# EAGLE design Curing_cab (EAGLE 7.2.0)
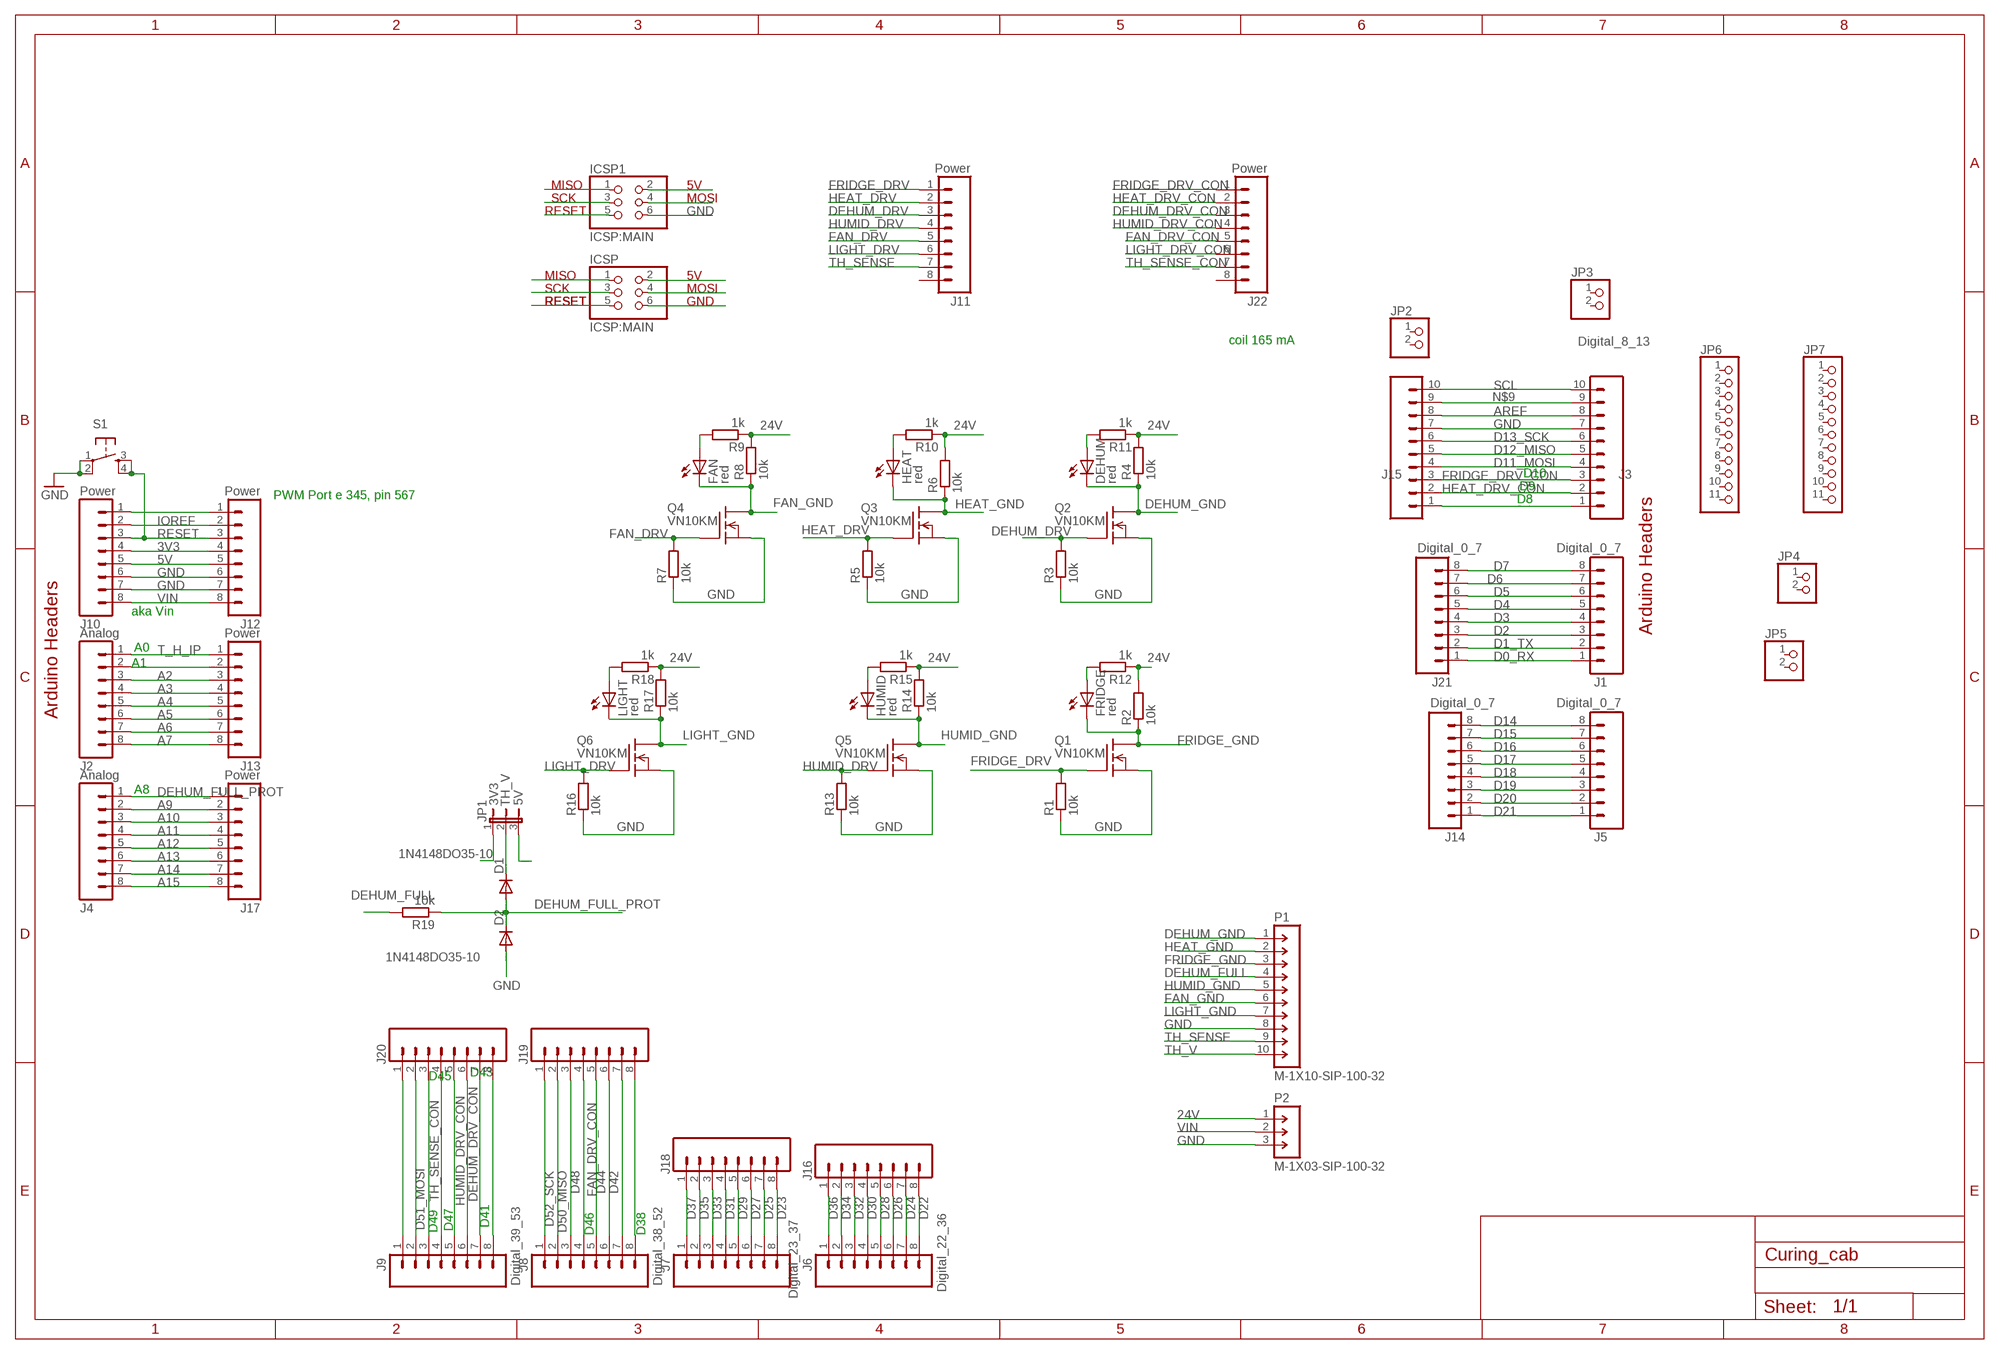
[diagram p0: schematic, sheet 1]

## Parts
D1  1N4148DO35-10  [DO35-10]
D2  1N4148DO35-10  [DO35-10]
DEHUM  red  LED3MM  [LED3MM]
FAN  red  LED3MM  [LED3MM]
FRIDGE  red  LED3MM  [LED3MM]
HEAT  red  LED3MM  [LED3MM]
HUMID  red  LED3MM  [LED3MM]
ICSP  ICSP:MAIN  PINHD-2X3  [2X03]
ICSP1  ICSP:MAIN  PINHD-2X3  [2X03]
J1  Digital_0_7  M08  [1X08]
J2  Analog  M08  [1X08]
J3  Digital_8_13  M100.1  [1X10]
J4  Analog  M08  [1X08]
J5  Digital_0_7  M08  [1X08]
J6  Digital_22_36  M08  [1X08]
J7  Digital_23_37  M08  [1X08]
J8  Digital_38_52  M08  [1X08]
J9  Digital_39_53  M08  [1X08]
J10  Power  M08  [1X08]
J11  Power  M08  [1X08]
J12  Power  M08  [1X08]
J13  Power  M08  [1X08]
J14  Digital_0_7  M08  [1X08]
J15  Digital_8_13  M100.1  [1X10]
J16  Digital_22_36  M08  [1X08]
J17  Power  M08  [1X08]
J18  Digital_22_36  M08  [1X08]
J19  Digital_22_36  M08  [1X08]
J20  Digital_22_36  M08  [1X08]
J21  Digital_0_7  M08  [1X08]
J22  Power  M08  [1X08]
JP1  JP2E  [JP2]
JP2  PINHD-1X2  [1X02]
JP3  PINHD-1X2  [1X02]
JP4  PINHD-1X2  [1X02]
JP5  PINHD-1X2  [1X02]
JP6  PINHD-1X11  [1X11]
JP7  PINHD-1X11  [1X11]
LIGHT  red  LED3MM  [LED3MM]
P1  M-1X10-SIP-100-32  [SIP-100-10-32]
P2  M-1X03-SIP-100-32  [SIP-100-03-32]
Q1  VN10KM  [TO237]
Q2  VN10KM  [TO237]
Q3  VN10KM  [TO237]
Q4  VN10KM  [TO237]
Q5  VN10KM  [TO237]
Q6  VN10KM  [TO237]
R1  10k  R-EU_0204/7  [0204/7]
R2  10k  R-EU_0204/7  [0204/7]
R3  10k  R-EU_0204/7  [0204/7]
R4  10k  R-EU_0204/7  [0204/7]
R5  10k  R-EU_0204/7  [0204/7]
R6  10k  R-EU_0204/7  [0204/7]
R7  10k  R-EU_0204/7  [0204/7]
R8  10k  R-EU_0204/7  [0204/7]
R9  1k  R-EU_0204/7  [0204/7]
R10  1k  R-EU_0204/7  [0204/7]
R11  1k  R-EU_0204/7  [0204/7]
R12  1k  R-EU_0204/7  [0204/7]
R13  10k  R-EU_0204/7  [0204/7]
R14  10k  R-EU_0204/7  [0204/7]
R15  1k  R-EU_0204/7  [0204/7]
R16  10k  R-EU_0204/7  [0204/7]
R17  10k  R-EU_0204/7  [0204/7]
R18  1k  R-EU_0204/7  [0204/7]
R19  10k  R-EU_0204/7  [0204/7]
S1  TAC_SWITCHPTH  [TACTILE-PTH]

## Nets
3V3: J10.4 J12.4 JP1.1
5V: J10.5 J12.5 JP1.3
5V_1: ICSP1.2 ICSP.2
24V: P2.1 R2.2 R4.2 R6.2 R8.2 R9.1 R10.1 R11.1 R12.1 R14.2 R15.1 R17.2 R18.1
A2: J2.3 J13.3
A3: J2.4 J13.4
A4: J2.5 J13.5
A5: J2.6 J13.6
A6: J2.7 J13.7
A7: J2.8 J13.8
A9: J4.2 J17.2
A10: J4.3 J17.3
A11: J4.4 J17.4
A12: J4.5 J17.5
A13: J4.6 J17.6
A14: J4.7 J17.7
A15: J4.8 J17.8
AREF: J3.8 J15.8
D0_RX: J1.1 J21.1
D1_TX: J1.2 J21.2
D2: J1.3 J21.3
D3: J1.4 J21.4
D4: J1.5 J21.5
D5: J1.6 J21.6
D6: J1.7 J21.7
D7: J1.8 J21.8
D11_MOSI: J3.4 J15.4
D12_MISO: J3.5 J15.5
D13_SCK: J3.6 J15.6
D14: J5.8 J14.8
D15: J5.7 J14.7
D16: J5.6 J14.6
D17: J5.5 J14.5
D18: J5.4 J14.4
D19: J5.3 J14.3
D20: J5.2 J14.2
D21: J5.1 J14.1
D22: J6.8 J16.8
D23: J7.8 J18.8
D24: J6.7 J16.7
D25: J7.7 J18.7
D26: J6.6 J16.6
D27: J7.6 J18.6
D28: J6.5 J16.5
D29: J7.5 J18.5
D30: J6.4 J16.4
D31: J7.4 J18.4
D32: J6.3 J16.3
D33: J7.3 J18.3
D34: J6.2 J16.2
D35: J7.2 J18.2
D36: J6.1 J16.1
D37: J7.1 J18.1
D42: J8.6 J19.6
D44: J8.5 J19.5
D48: J8.3 J19.3
D50_MISO: J8.2 J19.2
D51_MOSI: J9.2 J20.2
D52_SCK: J8.1 J19.1
D53: J9.1 J20.1
DEHUM_DRV: J11.3 Q2.2(G) R3.2
DEHUM_DRV_CON: J9.6 J20.6 J22.3
DEHUM_FULL: P1.4 R19.2
DEHUM_FULL_PROT: D1.A D2.C J4.1 J17.1 R19.1
DEHUM_GND: DEHUM.K(C) P1.1 Q2.1(D) R4.1
FAN_DRV: J11.5 Q4.2(G) R7.2
FAN_DRV_CON: J8.4 J19.4 J22.5
FAN_GND: FAN.K(C) P1.6 Q4.1(D) R8.1
FRIDGE_DRV: J11.1 Q1.2(G) R1.2
FRIDGE_DRV_CON: J3.3 J15.3 J22.1
FRIDGE_GND: FRIDGE.K(C) P1.3 Q1.1(D) R2.1
GND: D2.A ICSP1.6 ICSP.6 J3.7 J10.6 J10.7 J12.6 J12.7 J15.7 P1.8 P2.3 Q1.3(S) Q2.3(S) Q3.3(S) Q4.3(S) Q5.3(S) Q6.3(S) R1.1 R3.1 R5.1 R7.1 R13.1 R16.1 S1.1 S1.2
HEAT_DRV: J11.2 Q3.2(G) R5.2
HEAT_DRV_CON: J3.2 J15.2 J22.2
HEAT_GND: HEAT.K(C) P1.2 Q3.1(D) R6.1
HUMID_DRV: J11.4 Q5.2(G) R13.2
HUMID_DRV_CON: J9.5 J20.5 J22.4
HUMID_GND: HUMID.K(C) P1.5 Q5.1(D) R14.1
IOREF: J10.2 J12.2
LIGHT_DRV: J11.6 Q6.2(G) R16.2
LIGHT_DRV_CON: J9.4 J20.4 J22.6
LIGHT_GND: LIGHT.K(C) P1.7 Q6.1(D) R17.1
MISO_1: ICSP1.1 ICSP.1
MOSI_1: ICSP1.4 ICSP.4
N$1: HUMID.A R15.2
N$2: FAN.A R9.2
N$3: DEHUM.A R11.2
N$4: LIGHT.A R18.2
N$5: HEAT.A R10.2
N$7: J3.1 J15.1
N$8: FRIDGE.A R12.2
N$9: J3.9 J15.9
N$10: J2.2 J13.2
N$11: J9.7 J20.7
N$12: J9.8 J20.8
N$13: J8.8 J19.8
N$14: J8.7 J19.7
N$314: J10.1 J12.1
RESET: J10.3 J12.3 S1.3 S1.4
RESET_1: ICSP1.5 ICSP.5
SCK_1: ICSP1.3 ICSP.3
SCL: J3.10 J15.10
T_H_IP: J2.1 J13.1
TH_SENSE: J11.7 P1.9
TH_SENSE_CON: J9.3 J20.3 J22.7
TH_V: D1.C JP1.2 P1.10
VIN: J10.8 J12.8 P2.2
Unconnected: J11.8 J22.8 JP2.1 JP2.2 JP3.1 JP3.2 JP4.1 JP4.2 JP5.1 JP5.2 JP6.1 JP6.2 JP6.3 JP6.4 JP6.5 JP6.6 JP6.7 JP6.8 JP6.9 JP6.10 JP6.11 JP7.1 JP7.2 JP7.3 JP7.4 JP7.5 JP7.6 JP7.7 JP7.8 JP7.9 JP7.10 JP7.11

## Notes on the sheet
- MISO | 5V
- SCK | MOSI
- RESET
- MISO | 5V
- SCK | MOSI
- RESET | RESET | GND
- coil 165 mA
- D10
- D9
- PWM Port e 345, pin 567
- D8
- aka Vin
- Arduino Headers
- A0
- A1
- Arduino Headers
- A8
- D43
- D45
- D47
- D41
- D49 | D46 | D38

## Library data of the parts
D1 D2 = diode:1N4148: DIODE high speed (Philips)
DEHUM FAN FRIDGE HEAT HUMID LIGHT = led:LED: LED OSRAM: - CHIPLED LG R971, LG N971, LY N971, LG Q971, LY Q971, LO R971, LY R971 LH N974, LH R974 LS Q976, LO Q976, LY Q976 LO Q996 - Hyper CHIPLED LW Q18S LB Q993, LB Q99A, LB R99A - SideLED LS A670, LO A670, LY A670, LG A670, LP A670 LB A673, LV A673, LT A673, LW A673 LH A674 LY A675 LS A676, LA A676, LO A676, LY A676, LW A676 LS A679, LY A679, LG A679 - Hyper Micro SIDELED® LS Y876, LA Y876, LO Y876, LY Y876 LT Y87S - SmartLED LW L88C, LW L88S LB L89C, LB L89S, LG L890 LS L89K, LO L89K, LY L89K LS L896, LA L896, LO L896, LY L896 - TOPLED LS T670, LO T670, LY T670, LG T670, LP T670 LSG T670, LSP T670, LSY T670, LOP T670, LYG T670 LG T671, LOG T671, LSG T671 LB T673, LV T673, LT T673, LW T673 LH T674 LS T676, LA T676, LO T676, LY T676, LB T676, LH T676, LSB T676, LW T676 LB T67C, LV T67C, LT T67C, LS T67K, LO T67K, LY T67K, LW E67C LS E67B, LA E67B, LO E67B, LY E67B, LB E67C, LV E67C, LT E67C LW T67C LS T679, LY T679, LG T679 LS T770, LO T770, LY T770, LG T770, LP T770 LB T773, LV T773, LT T773, LW T773 LH T774 LS E675, LA E675, LY E675, LS T675 LS T776, LA T776, LO T776, LY T776, LB T776 LHGB T686 LT T68C, LB T68C - Hyper Mini TOPLED® LB M676 - Mini TOPLED Santana® LG M470 LS M47K, LO M47K, LY M47K Source: http://www.osram.convergy.de LUXEON: - LUMILED® LXK2-PW12-R00, LXK2-PW12-S00, LXK2-PW14-U00, LXK2-PW14-V00 LXK2-PM12-R00, LXK2-PM12-S00, LXK2-PM14-U00 LXK2-PE12-Q00, LXK2-PE12-R00, LXK2-PE12-S00, LXK2-PE14-T00, LXK2-PE14-U00 LXK2-PB12-K00, LXK2-PB12-L00, LXK2-PB12-M00, LXK2-PB14-N00, LXK2-PB14-P00, LXK2-PB14-Q00 LXK2-PR12-L00, LXK2-PR12-M00, LXK2-PR14-Q00, LXK2-PR14-R00 LXK2-PD12-Q00, LXK2-PD12-R00, LXK2-PD12-S00 LXK2-PH12-R00, LXK2-PH12-S00 LXK2-PL12-P00, LXK2-PL12-Q00, LXK2-PL12-R00 Source: www.luxeon.com KINGBRIGHT: KA-3528ASYC Source: www.kingbright.com
ICSP ICSP1 = pinhead:PINHD-2X3: PIN HEADER
J1 J5-J9 J14 J16 J18-J21 = freetronics:M08: Header 8 Standard 8-pin 0.1" header. Use with straight break away headers (SKU : PRT-00116), right angle break away headers (PRT-00553), swiss pins (PRT-00743), machine pins (PRT-00117), and female headers (PRT-00115).
J2 J4 J10-J13 J17 J22 = freetronics-master-v1:M08: Header 8 Standard 8-pin 0.1" header. Use with straight break away headers (SKU : PRT-00116), right angle break away headers (PRT-00553), swiss pins (PRT-00743), machine pins (PRT-00117), and female headers (PRT-00115).
J3 J15 = freetronics-original:M10: Header 10 Standard 10-pin 0.1" header. Use with straight break away headers (SKU : PRT-00116), right angle break away headers (PRT-00553), swiss pins (PRT-00743), machine pins (PRT-00117), and female headers (PRT-00115).
JP1 = jumper:JP2E: JUMPER
JP2-JP5 = pinhead:PINHD-1X2: PIN HEADER
JP6 JP7 = pinhead:PINHD-1X11: PIN HEADER
P1 = con-headers-jp:M-1X10-: MALE HEADER
P2 = con-headers-jp:M-1X03-: MALE HEADER
Q1-Q6 = Trevs:VN10: N-Channel Enhancement MOSFET (VMOS); 60V; 0,5A; 5,0Ohm
R1-R19 = resistor:R-EU_: RESISTOR, European symbol
S1 = freetronics-master-v1:TAC_SWITCH: Momentary Switch Button commonly used for reset or general input. Spark Fun Electronics SKU : COM-00097

## Board
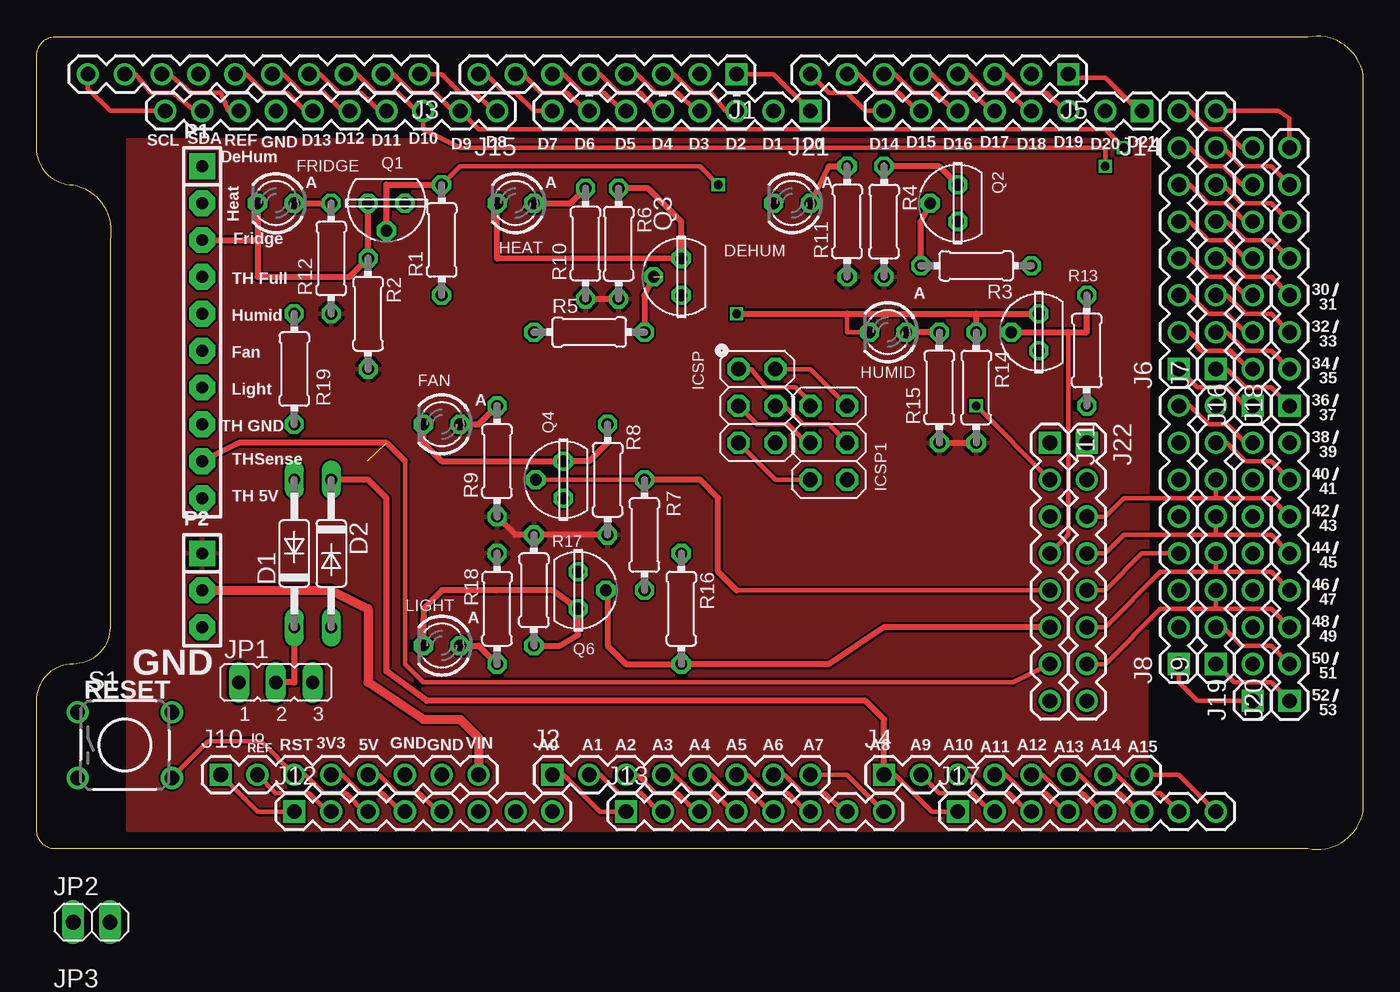
[diagram p1: board, top side]
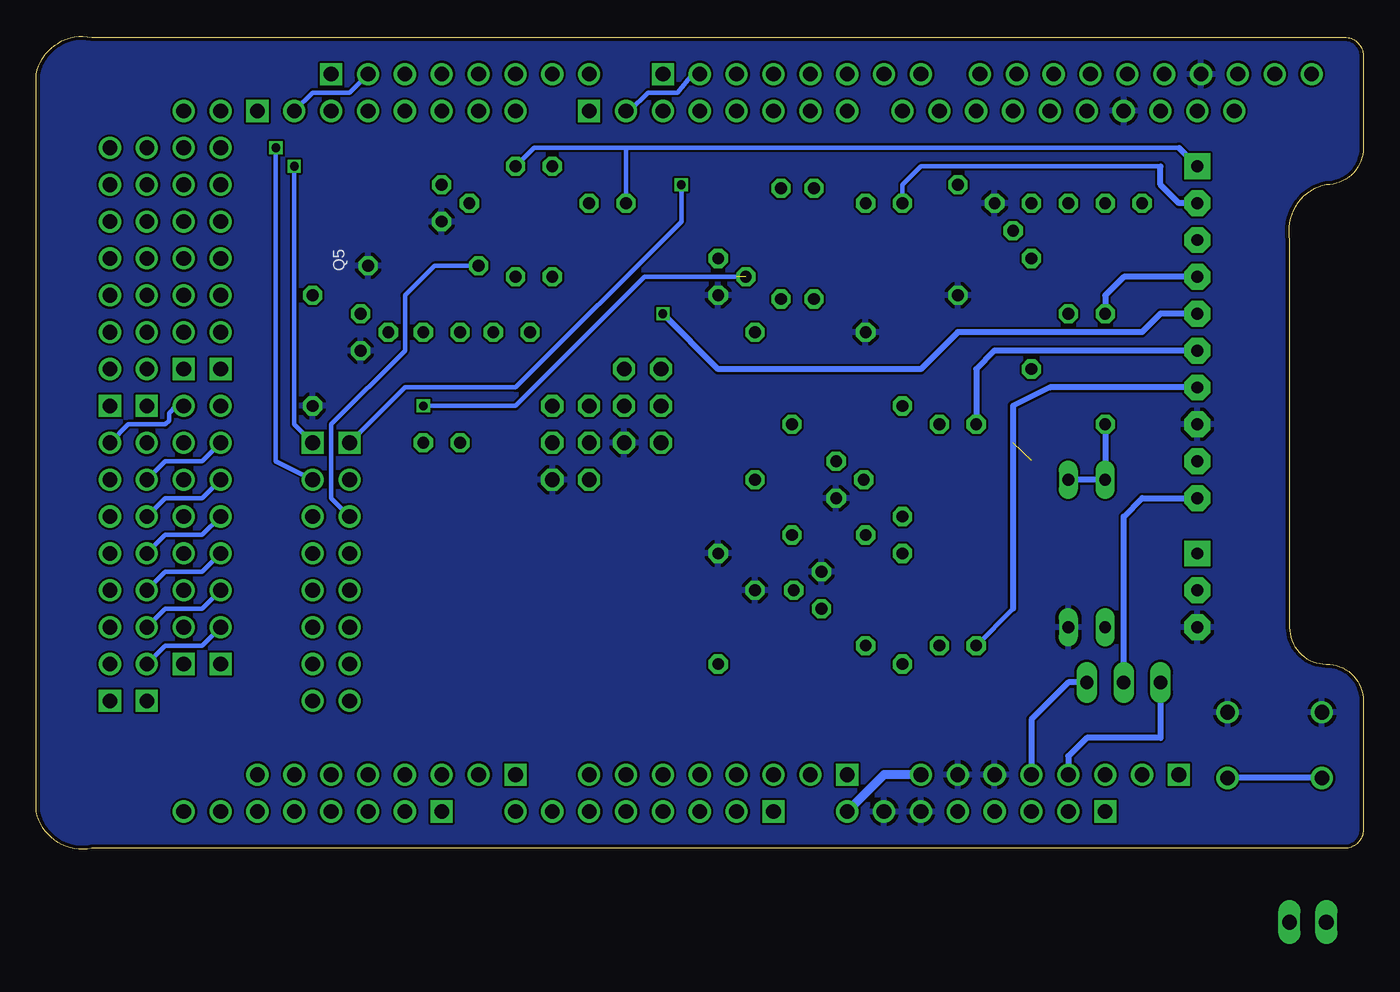
[diagram p2: board, bottom side, seen from below]

Size 91.44 x 56.01 mm. Coordinates in mm from the lower left corner, seen from the top.
Outline: 0,1.33 arc90 1.27,0.06 87.63,0.06 arc90 91.44,2.6 91.44,53.4 arc90 87.63,55.94 1.27,55.94 arc90 0,54.67 0,48.32 arc90 2.54,45.78 arc-90 5.08,41.97 5.08,15.3 arc-90 2.54,12.76 arc90 0,10.22 0,1.33
Copper layers (1*16): Top 0.035mm / dielectric 1.5mm / Bottom 0.035mm
Design rules "SeeedStudio_2layer_DRU_no_angle_20140221": minimum track width 6mil, minimum drill 12mil, track to track 6mil, track to pad 6mil, pad to pad 6mil, via to via 6mil, smd to smd 0mil, copper to edge 10mil, drill to drill 10mil, minimum pad ring 10mil, minimum via ring 6mil, stop-mask expansion 2mil, vias tented up to drill 100mil, thermal gap 10mil

### Footprints (pad centres in the part's own frame; a part is rotated, then mirrored left to right if it is on the bottom)
DO35-10 = drill 0.813 long: A 5.08,0; C -5.08,0
LED3MM = drill 0.813 octagon: A -1.27,0; K 1.27,0
2X03 = drill 1.016 octagon: 1 -2.54,-1.27; 2 -2.54,1.27; 3 0,-1.27; 4 0,1.27; 5 2.54,-1.27; 6 2.54,1.27
1X08 = drill 1.016 square: 1 0,0 | drill 1.016: 2 2.54,0; 3 5.08,0; 4 7.62,0; 5 10.16,0; 6 12.7,0; 7 15.24,0; 8 17.78,0
1X10 = drill 1.016: 1 0,0; 2 2.54,0; 3 5.08,0; 4 7.62,0; 5 10.16,0; 6 12.7,0; 7 15.24,0; 8 17.78,0; 9 20.32,0; 10 22.86,0
JP2 = drill 0.914 long: 1 -2.54,0; 2 0,0; 3 2.54,0
1X02 = drill 1.016 long: 1 -1.27,0; 2 1.27,0
1X11 = drill 1.016 long: 1 -12.7,0; 2 -10.16,0; 3 -7.62,0; 4 -5.08,0; 5 -2.54,0; 6 0,0; 7 2.54,0; 8 5.08,0; 9 7.62,0; 10 10.16,0; 11 12.7,0
SIP-100-10-32 = drill 0.813 pad 1.778 square: 1 -11.43,0 | drill 0.813 pad 1.778 octagon: 2 -8.89,0; 3 -6.35,0; 4 -3.81,0; 5 -1.27,0; 6 1.27,0; 7 3.81,0; 8 6.35,0; 9 8.89,0; 10 11.43,0
SIP-100-03-32 = drill 0.813 pad 1.778 square: 1 -2.54,0 | drill 0.813 pad 1.778 octagon: 2 0,0; 3 2.54,0
TO237 = drill 0.813 octagon: 1 1.27,0; 2 0,1.905; 3 -1.27,0
0204/7 = drill 0.813 octagon: 1 -3.81,0; 2 3.81,0
TACTILE-PTH = drill 1.016: 1 -3.251,2.261; 2 3.251,2.261; 3 -3.251,-2.261; 4 3.251,-2.261

### Placement (x,y rotation side)
D1  17.78,20.38 90 top
D2  20.32,20.38 270 top
DEHUM  52.07,44.51 180 top
FAN  27.94,29.27 180 top
FRIDGE  16.51,44.51 180 top
HEAT  33.02,44.51 180 top
HUMID  58.67,35.62 180 top
ICSP  49.66,30.54 270 top
ICSP1  54.61,28 270 top
J1  48.26,53.4 180 top
J2  35.56,5.14 0 top
J3  26.42,53.4 180 top
J4  58.42,5.14 0 top
J5  71.12,53.4 180 top
J6  78.74,33.08 90 top
J7  81.28,33.08 90 top
J8  78.74,12.76 90 top
J9  81.28,12.76 90 top
J10  12.7,5.14 0 top
J11  69.85,28 270 top
J12  17.78,2.6 0 top
J13  40.64,2.6 0 top
J14  76.2,50.86 180 top
J15  31.75,50.86 180 top
J16  83.82,30.54 90 top
J17  63.5,2.6 0 top
J18  86.36,30.54 90 top
J19  83.82,10.22 90 top
J20  86.36,10.22 90 top
J21  53.34,50.86 180 top
J22  72.39,28 270 top
JP1  16.51,11.49 0 top
JP2  3.81,-5.02 0 top  (outside the outline)
JP3  3.81,-11.37 0 top  (outside the outline)
JP4  3.81,-17.72 0 top  (outside the outline)
JP5  3.81,-24.07 0 top  (outside the outline)
JP6  15.24,-30.42 0 top  (outside the outline)
JP7  15.24,-36.77 0 top  (outside the outline)
LIGHT  27.94,14.03 180 top
P1  11.43,35.62 270 top
P2  11.43,17.84 270 top
Q1  24.13,44.51 180 top
Q2  63.5,44.51 90 top
Q3  44.45,39.43 90 top
Q4  36.32,25.46 90 top
Q5  69.09,35.62 90 top
Q6  37.34,17.84 270 top
R1  27.94,41.97 90 top
R2  22.86,36.89 270 top
R3  64.77,40.19 180 top
R4  58.42,43.24 270 top
R5  38.1,35.62 0 top
R6  40.13,41.72 270 top
R7  41.91,21.65 90 top
R8  39.37,25.46 270 top
R9  31.75,26.73 90 top
R10  37.85,41.72 90 top
R11  55.88,43.24 90 top
R12  20.32,40.7 90 top
R13  72.39,34.35 90 top
R14  64.77,31.81 270 top
R15  62.23,31.81 90 top
R16  44.45,16.57 270 top
R17  34.29,17.84 90 top
R18  31.75,16.57 270 top
R19  17.78,33.08 90 top
S1  6.1,7.17 0 top

### Tracks (layer width: path | path; a pad name or v marks a point on that pad's centre or on a via)
3V3
  Top 0.305: J10.4 21.08,5.14 22.35,3.87 23.88,3.87 25.15,2.6 J12.4
  Bottom 0.406: JP1.1 13.97,7.68 19.05,7.68 20.32,6.41 J10.4
5V
  Top 0.305: J10.5 23.62,5.14 24.89,3.87 26.42,3.87 27.69,2.6 J12.5
  Bottom 0.406: JP1.3 20.32,11.49 22.86,8.95 J10.5
5V_1
  Top 0.305: ICSP.2 53.34,33.08 ICSP1.2
24V
  Top 0.406: R15.1 R14.2 | R9.1 33.02,21.65 R8.2 | R10.1 R6.2
  pour Top: 6.35,48.83 76.71,48.83 76.45,1.33 6.35,1.33
A2
  Top 0.305: J2.3 41.4,5.14 42.67,3.87 44.2,3.87 45.47,2.6 J13.3
A3
  Top 0.305: J2.4 43.94,5.14 45.21,3.87 46.74,3.87 48.01,2.6 J13.4
A4
  Top 0.305: J2.5 46.48,5.14 47.75,3.87 49.28,3.87 50.55,2.6 J13.5
A5
  Top 0.305: J2.6 49.02,5.14 50.29,3.87 51.82,3.87 53.09,2.6 J13.6
A6
  Top 0.305: J2.7 51.56,5.14 52.83,3.87 54.36,3.87 55.63,2.6 J13.7
A7
  Top 0.305: J2.8 55.88,5.14 J13.8
A9
  Top 0.305: J4.2 62.23,3.87 64.52,3.87 65.79,2.6 J17.2
A10
  Top 0.305: J4.3 64.26,5.14 65.53,3.87 67.06,3.87 68.33,2.6 J17.3
A11
  Top 0.305: J4.4 66.8,5.14 68.07,3.87 69.6,3.87 70.87,2.6 J17.4
A12
  Top 0.305: J4.5 69.34,5.14 70.61,3.87 72.14,3.87 73.41,2.6 J17.5
A13
  Top 0.305: J4.6 71.88,5.14 73.15,3.87 74.68,3.87 75.95,2.6 J17.6
A14
  Top 0.305: J4.7 74.42,5.14 75.69,3.87 77.47,3.87 J17.7
A15
  Top 0.305: J4.8 78.74,5.14 J17.8
AREF
  Top 0.305: J3.8 9.14,53.4 10.67,52.13 12.7,52.13 13.21,50.86 J15.8
D0_RX
  Top 0.305: J1.1 50.8,53.4 J21.1
D1_TX
  Bottom 0.305: J1.2 46.23,53.4 47.24,52.13 49.28,52.13 50.55,50.86 J21.2
D2
  Top 0.305: J1.3 43.94,53.4 45.21,52.13 46.48,52.13 47.5,50.86 J21.3
D3
  Top 0.305: J1.4 41.4,53.4 42.67,52.13 44.2,52.13 45.47,50.86 J21.4
D4
  Top 0.305: J1.5 38.86,53.4 40.13,52.13 41.66,52.13 42.67,50.86 J21.5
D5
  Top 0.305: J1.6 36.32,53.4 37.59,52.13 39.12,52.13 40.39,50.86 J21.6
D6
  Top 0.305: J1.7 33.53,53.4 34.8,52.13 36.58,52.13 37.85,50.86 J21.7
D7
  Top 0.305: J1.8 30.99,53.4 32.26,52.13 33.02,52.13 34.29,50.86 J21.8
D11_MOSI
  Top 0.305: J3.4 19.56,53.4 20.83,52.13 22.35,52.13 23.62,50.86 J15.4
D12_MISO
  Top 0.305: J3.5 17.02,53.4 18.29,52.13 19.81,52.13 21.08,50.86 J15.5
D13_SCK
  Top 0.305: J3.6 14.48,53.4 15.75,52.13 17.27,52.13 18.54,50.86 J15.6
D14
  Top 0.305: J5.8 54.61,52.13 55.88,52.13 57.15,50.86 J14.8
D15
  Top 0.305: J5.7 56.64,53.4 57.91,52.13 59.44,52.13 60.71,50.86 J14.7
D16
  Top 0.305: J5.6 59.18,53.4 60.45,52.13 61.98,52.13 63.25,50.86 J14.6
D17
  Top 0.305: J5.5 61.72,53.4 62.99,52.13 64.52,52.13 65.79,50.86 J14.5
D18
  Top 0.305: J5.4 64.26,53.4 65.53,52.13 67.06,52.13 68.33,50.86 J14.4
D19
  Top 0.305: J5.3 66.8,53.4 68.07,52.13 69.6,52.13 70.87,50.86 J14.3
D20
  Bottom 0.305: J5.2 69.85,52.13 72.39,52.13 J14.2
D21
  Top 0.305: J5.1 71.37,53.15 73.66,53.15 75.95,50.86 J14.1
D22
  Top 0.305: J6.8 79.5,50.86 80.77,49.59 81.79,49.59 83.06,48.32 J16.8
D23
  Top 0.305: J7.8 85.6,50.86 86.36,50.35 J18.8
D24
  Top 0.305: J6.7 79.5,48.32 80.77,47.05 81.79,47.05 83.06,45.78 J16.7
D25
  Top 0.305: J7.7 81.79,48.32 83.06,47.05 85.09,47.05 J18.7
D26
  Top 0.305: J6.6 79.5,45.78 80.77,44.51 82.04,44.51 83.31,43.24 J16.6
D27
  Top 0.305: J7.6 81.79,45.78 83.06,44.51 85.09,44.51 J18.6
D28
  Top 0.305: J6.5 79.5,43.24 80.77,41.97 82.04,41.97 83.31,40.7 J16.5
D29
  Top 0.305: J7.5 82.04,43.24 83.31,41.97 85.09,41.97 J18.5
D30
  Top 0.305: J6.4 79.5,40.7 80.77,39.43 82.04,39.43 83.31,38.16 J16.4
D31
  Top 0.305: J7.4 82.04,40.7 83.31,39.43 85.09,39.43 J18.4
D32
  Top 0.305: J6.3 79.5,38.16 80.77,36.89 82.04,36.89 83.31,35.62 J16.3
D33
  Top 0.305: J7.3 82.04,38.16 83.31,36.89 85.09,36.89 J18.3
D34
  Top 0.305: J6.2 79.5,35.62 80.01,35.11 80.01,34.61 80.26,34.35 82.3,34.35 83.57,33.08 J16.2
D35
  Top 0.305: J7.2 82.04,35.62 83.31,34.35 85.09,34.35 J18.2
D36
  Top 0.305: J6.1 80.01,31.81 82.04,31.81 83.31,30.54 J16.1
D37
  Top 0.305: J7.1 82.04,33.08 83.31,31.81 85.09,31.81 J18.1
D42
  Bottom 0.305: J19.6 82.55,24.19 80.01,24.19 J8.6
D44
  Bottom 0.305: J19.5 82.55,21.65 80.01,21.65 J8.5
D48
  Bottom 0.305: J8.3 80.01,16.57 82.55,16.57 J19.3
D50_MISO
  Bottom 0.305: J8.2 80.01,14.03 82.55,14.03 J19.2
D51_MOSI
  Top 0.305: J20.2 85.09,14.03 83.06,14.03 81.79,15.3 J9.2
D52_SCK
  Top 0.305: J19.1 80.01,10.22 78.74,11.49 J8.1
D53
  Top 0.305: J20.1 85.09,11.49 82.55,11.49 J9.1
DEHUM_DRV
  Top 0.406: Q2.2 60.96,43.24 R3.2
  Bottom 0.305: R3.2 64.01,40.19 66.04,38.16 66.04,34.35 71.12,29.27 71.12,24.19 J11.3
DEHUM_DRV_CON
  Top 0.305: J20.6 85.09,24.19 81.79,24.19 81.28,24.19 | 81.28,24.19 J9.6 | J22.3 73.66,22.92 74.93,24.19 81.28,24.19
DEHUM_FULL
  Bottom 0.406: P1.4 16.51,39.43 17.78,38.16 R19.2
DEHUM_FULL_PROT
  Top 0.305: J4.1 59.18,5.14 61.72,2.6 J17.1
  Top 0.406: J4.1 58.42,8.95 57.15,10.22 26.92,10.22 24.13,12.25 24.13,24.19 22.86,25.46 D2.C
  Bottom 0.406: R19.1 D1.A D2.C
DEHUM_GND
  Top 0.406: Q2.1 62.23,47.05 R4.1
  Bottom 0.305: 12.7,48.32 50.8,48.32 | DEHUM.K 50.8,48.32 | 50.8,48.32 57.15,48.32 R4.1
  Bottom 0.406: 12.7,48.32 P1.1
FAN_DRV
  Top 0.305: R7.2 Q4.2 | 48.26,17.84 J11.5
  Top 0.406: 48.26,17.84 46.99,19.11 46.99,24.19 45.72,25.46 R7.2
FAN_DRV_CON
  Top 0.305: J22.5 73.66,17.84 76.2,20.38 J8.4
  Bottom 0.305: J19.4 82.55,19.11 80.01,19.11 J8.4
FAN_GND
  Top 0.406: FAN.K 26.67,28 27.94,26.73 Q4.1 38.1,26.73 39.37,28 R8.1
  Bottom 0.406: P1.6 25.4,34.35 26.67,33.08 FAN.K
FRIDGE_DRV  (via drill 0.6)
  Top 0.305: R1.2 29.21,47.05 45.72,47.05 v46.99,45.78
  Top 0.406: Q1.2 24.13,45.78 R1.2
  Bottom 0.305: v46.99,45.78 46.99,43.24 58.42,31.81 66.04,31.81 J11.1
FRIDGE_DRV_CON  (via drill 0.6)
  Top 0.305: J3.3 22.1,53.4 23.37,52.13 24.89,52.13 26.16,50.86 J15.3 | J15.3 26.67,50.61 | J15.3 26.67,49.59 29.21,48.32 73.66,48.32 v73.66,47.05
  Bottom 0.305: v73.66,47.05 73.66,29.27 J22.1
FRIDGE_GND
  Top 0.406: Q1.1 R2.1 21.59,39.43 15.24,39.43 15.24,41.97 | FRIDGE.K 15.24,41.97 | P1.3 15.24,41.97
GND
  pour Bottom: 0,54.67 arc-74 1.27,55.94 87.63,55.94 arc-74 91.44,53.4 91.44,2.6 arc-74 87.63,0.06 1.27,0.06 arc-74 0,1.33 0,10.22 arc-90 2.54,12.76 arc90 5.08,15.3 5.08,43.24 arc90 2.54,45.78 arc-90 0,48.32
HEAT_DRV  (via drill 0.6)  (1 unrouted)
  Top 0.305: J11.2 v64.77,30.54
  Top 0.406: Q3.2 41.91,38.16 R5.2
  Bottom 0.305: v64.77,30.54 58.42,30.54 49.53,39.43 43.18,39.43
HEAT_DRV_CON  (via drill 0.6)
  Top 0.305: J3.2 24.64,53.4 25.91,52.13 27.43,52.13 28.7,50.86 J15.2 30.48,49.59 73.66,49.59 v74.93,48.32
  Bottom 0.305: v74.93,48.32 74.93,26.73 J22.2
HEAT_GND
  Top 0.406: HEAT.K 31.77,40.95 31.77,40.7 Q3.1 44.45,43.24 42.16,45.53 R6.1
  Bottom 0.305: 13.97,47.05 30.48,47.05 31.75,45.78 HEAT.K
  Bottom 0.406: P1.2 12.7,44.51 13.97,45.78 13.97,47.05
HUMID_DRV
  Top 0.305: J11.4 71.12,21.65 71.12,35.62
  Top 0.406: Q5.2 71.12,35.62 72.39,35.62 R13.2
HUMID_DRV_CON
  Top 0.305: J20.5 85.09,21.65 83.06,21.65 81.28,21.65 | 81.28,21.65 J9.5 | J22.4 73.66,20.38 74.93,21.65 81.28,21.65
HUMID_GND  (via drill 0.6)
  Top 0.305: 55.88,36.89 55.88,35.62 HUMID.K
  Top 0.406: 64.77,36.89 55.88,36.89 v48.26,36.89 | R14.1 64.77,36.89 | 64.77,36.89 Q5.1
  Bottom 0.406: P1.5 13.97,36.89 15.24,35.62 27.94,35.62 30.48,33.08 44.45,33.08 v48.26,36.89
IOREF
  Top 0.305: J10.2 16.51,3.87 18.8,3.87 20.07,2.6 J12.2
LIGHT_DRV
  Top 0.406: Q6.2 39.37,17.84 39.37,14.03 40.64,12.76 R16.2 54.61,12.76 58.42,15.3 J11.6
LIGHT_DRV_CON
  Top 0.305: J20.4 85.09,19.11 82.55,19.11 81.28,19.11 | 81.28,19.11 J9.4 | J22.6 73.66,15.3 77.47,19.11 81.28,19.11
LIGHT_GND
  Top 0.406: LIGHT.K 26.67,15.3 26.69,16.55 27.96,17.85 31.75,17.84 35.56,17.84 Q6.1 37.34,14.79 36.07,14.03 R17.1
  Bottom 0.305: 24.13,16.57 LIGHT.K
  Bottom 0.406: 24.13,16.57 24.13,30.54 21.59,31.81 P1.7
MISO_1
  Top 0.305: ICSP.1 49.28,33.08 50.29,31.81 52.32,31.81 53.34,30.8 ICSP1.1
MOSI_1
  Top 0.305: ICSP.4 51.56,30.54 52.83,29.27 54.61,29.27 ICSP1.4
N$1
  Top 0.406: R15.2 HUMID.A
N$2
  Top 0.406: FAN.A 30.48,29.27 R9.2
N$3
  Top 0.406: DEHUM.A 54.61,47.05 R11.2
N$4
  Top 0.406: LIGHT.A 30.48,14.03 R18.2
N$5
  Top 0.406: HEAT.A 36.83,44.51 R10.2
N$7
  Top 0.305: J3.1 27.94,53.4 29.21,52.13 30.23,52.13 31.5,50.86 J15.1
N$8
  Top 0.406: FRIDGE.A R12.2
N$9
  Top 0.305: J3.9 6.86,53.4 7.87,52.13 9.4,52.13 10.92,50.86 J15.9
N$10
  Top 0.305: J2.2 38.86,5.14 40.13,3.87 41.66,3.87 42.93,2.6 J13.2
N$11
  Top 0.305: J9.7 82.04,28 83.31,26.73 85.09,26.73 J20.7
N$12
  Bottom 0.305: J9.8 81.79,30.54 82.3,30.03 82.3,29.53 82.55,29.27 85.09,29.27 J20.8
N$13
  Top 0.305: J8.8 79.5,30.54 80.77,29.27 82.04,29.27 83.31,28 J19.8
N$14
  Bottom 0.305: J19.7 82.55,26.73 80.01,26.73 J8.7
N$314
  Top 0.305: J10.1 15.24,2.6 J12.1
RESET
  Top 0.305: S1.4 11.86,7.43 15.49,7.43 J10.3 18.54,5.14 19.81,3.87 21.34,3.87 22.61,2.6 J12.3
  Bottom 0.406: S1.3 S1.4
RESET_1
  Top 0.305: ICSP.5 50.93,25.46 ICSP1.5
SCK_1
  Top 0.305: ICSP.3 49.66,29.27 51.82,29.27 53.09,28 ICSP1.3
SCL
  Top 0.305: J3.10 3.56,52.39 5.08,50.86 J15.10
T_H_IP
  Top 0.305: J2.1 36.32,5.14 38.86,2.6 J13.1
TH_SENSE  (1 unrouted)
  Top 0.305: J11.7 67.31,11.49 26.67,11.49 25.4,12.76 25.4,26.73
  Top 0.406: 25.4,26.73 24.13,28 13.97,28 P1.9
TH_SENSE_CON
  Top 0.305: 81.28,16.57 J9.3 | J22.7 73.66,12.76 77.47,16.57 81.28,16.57 | 81.28,16.57 82.8,16.57 85.09,16.57 J20.3
TH_V
  Top 0.406: D1.C 17.78,11.49 JP1.2
  Bottom 0.406: JP1.2 16.51,22.92 15.24,24.19 P1.10
VIN
  Top 0.61: P2.2 20.32,17.84 22.86,16.57 22.86,11.49 26.67,8.95 29.21,8.95 30.48,7.68 J10.8
  Bottom 0.61: J10.8 33.02,5.14 J12.8

### Text on the board
tPlace: SDA | D12 | D10 | SCL | REF | GND | D13 | D11 | D9 | D8 | D7 | D6 | D5 | D4 | D3 | D2 | D1 | D0 | D14 | D15 | D16 | D17 | D18 | D19 | D20 | D21 | DeHum | A | A | A | Heat | Fridge | TH Full | A | 30 | 31 | Humid | 32 | 33 | Fan | 34 | 35 | Light | A | 36 | TH GND | 37 | 38 | 39 | THSense | 40 | TH 5V | 41 | 42 | 43 | 44 | 45 | 46 | 47 | A | 48 | 49 | 50 | GND | 51 | RESET | 52 | 53 | REF | IO | RST | 3V3 | 5V | GND | GND | VIN | A0 | A1 | A2 | A3 | A4 | A5 | A6 | A7 | A8 | A9 | A10 | A11 | A12 | A13 | A14 | A15
Document: Curing_Cab_I/O / V0.01 / Copyright Pending